# Altium schematic sheet LdcPower.SchDoc
size A4
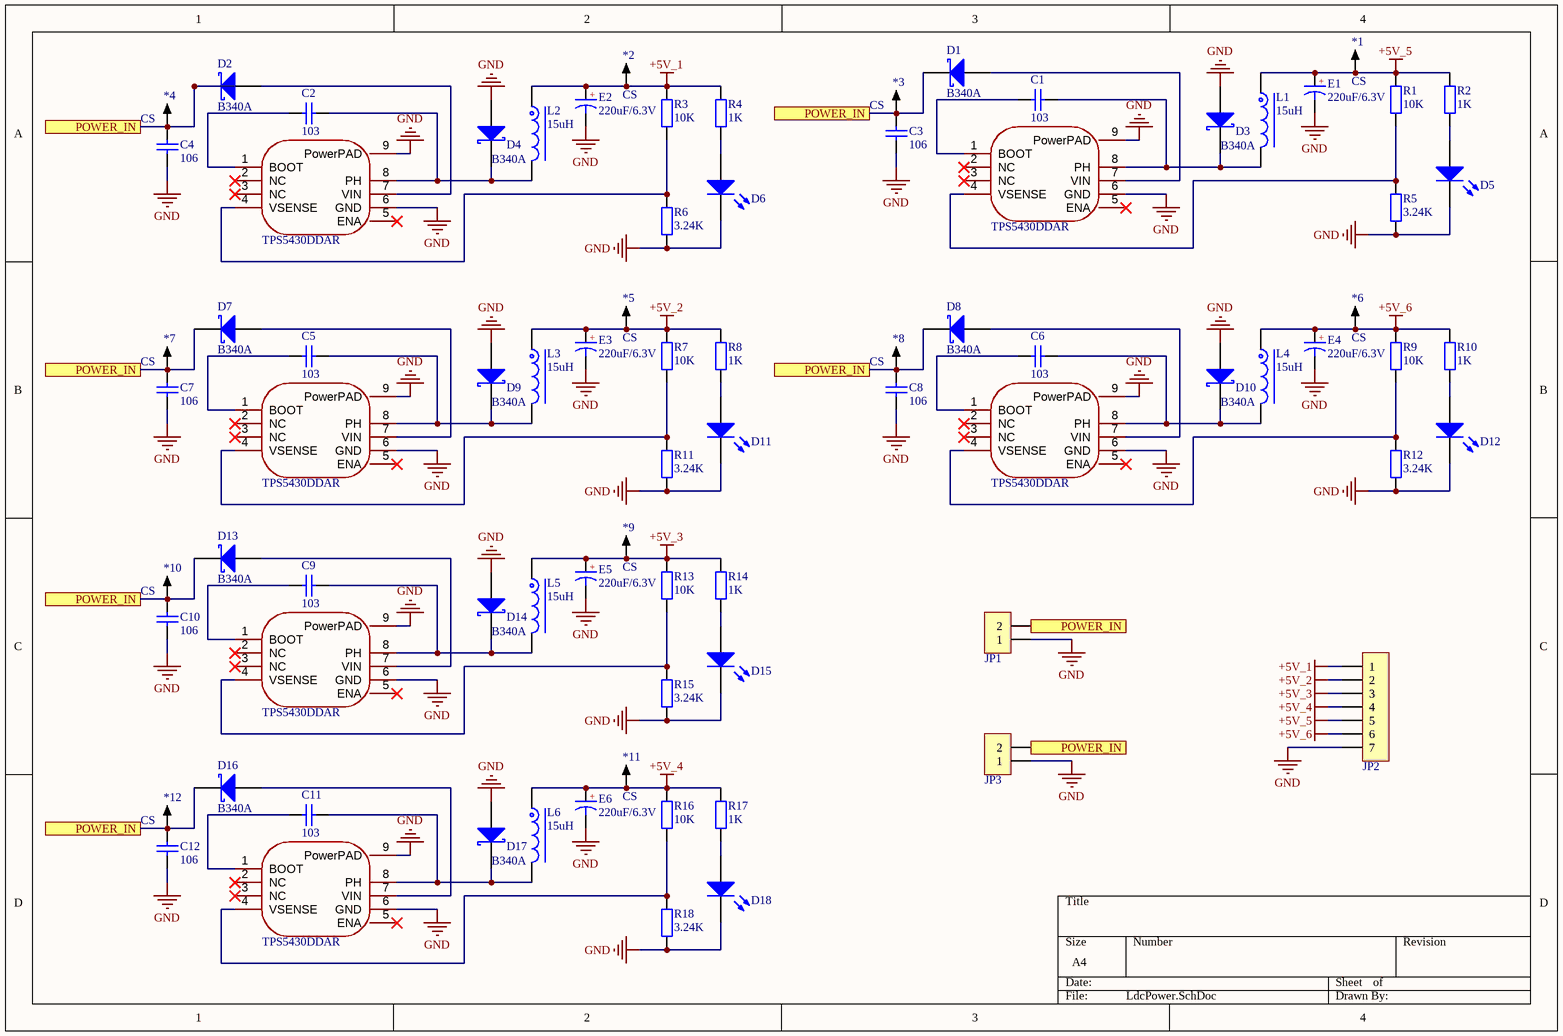
[diagram p0: LdcPower.SchDoc]

## Parts
*1  CS  [TEST 1.2]
*2  CS  [TEST 1.2]
*3  CS  [TEST 1.2]
*4  CS  [TEST 1.2]
*5  CS  [TEST 1.2]
*6  CS  [TEST 1.2]
*7  CS  [TEST 1.2]
*8  CS  [TEST 1.2]
*9  CS  [TEST 1.2]
*10  CS  [TEST 1.2]
*11  CS  [TEST 1.2]
*12  CS  [TEST 1.2]
C1  103  [C0603_L]
C2  103  [C0603_L]
C3  106  [C0603_L]
C4  106  [C0603_L]
C5  103  [C0603_L]
C6  103  [C0603_L]
C7  106  [C0603_L]
C8  106  [C0603_L]
C9  103  [C0603_L]
C10  106  [C0603_L]
C11  103  [C0603_L]
C12  106  [C0603_L]
D1  B340A  [SMA]
D2  B340A  [SMA]
D3  B340A  [SMA]
D4  B340A  [SMA]
D5  LED  [LED0603_R]  (value not drawn)
D6  LED  [LED0603_R]  (value not drawn)
D7  B340A  [SMA]
D8  B340A  [SMA]
D9  B340A  [SMA]
D10  B340A  [SMA]
D11  LED  [LED0603_R]  (value not drawn)
D12  LED  [LED0603_R]  (value not drawn)
D13  B340A  [SMA]
D14  B340A  [SMA]
D15  LED  [LED0603_R]  (value not drawn)
D16  B340A  [SMA]
D17  B340A  [SMA]
D18  LED  [LED0603_R]  (value not drawn)
E1  220uF/6.3V  [C_3528]
E2  220uF/6.3V  [C_3528]
E3  220uF/6.3V  [C_3528]
E4  220uF/6.3V  [C_3528]
E5  220uF/6.3V  [C_3528]
E6  220uF/6.3V  [C_3528]
JP1  HDR-1X2  [CONN-TH_XT60PW-M]  (value not drawn)
JP2  HDR-1X7  [CONN-SMD_7P-P2.54_MEGASTAR_ZX-XH2.54-7PWT]  (value not drawn)
JP3  HDR-1X2  [CONN-SMD_2P-P2.54_MEGASTAR_ZX-XH2.54-2PWT]  (value not drawn)
L1  15uH  [L-SMD-0630]
L2  15uH  [L-SMD-0630]
L3  15uH  [L-SMD-0630]
L4  15uH  [L-SMD-0630]
L5  15uH  [L-SMD-0630]
L6  15uH  [L-SMD-0630]
R1  10K  [R0603_L]
R2  1K  [R0603_L]
R3  10K  [R0603_L]
R4  1K  [R0603_L]
R5  3.24K  [R0603_L]
R6  3.24K  [R0603_L]
R7  10K  [R0603_L]
R8  1K  [R0603_L]
R9  10K  [R0603_L]
R10  1K  [R0603_L]
R11  3.24K  [R0603_L]
R12  3.24K  [R0603_L]
R13  10K  [R0603_L]
R14  1K  [R0603_L]
R15  3.24K  [R0603_L]
R16  10K  [R0603_L]
R17  1K  [R0603_L]
R18  3.24K  [R0603_L]
U1  TPS5430DDAR  [SOIC-8_EP]
U2  TPS5430DDAR  [SOIC-8_EP]
U3  TPS5430DDAR  [SOIC-8_EP]
U4  TPS5430DDAR  [SOIC-8_EP]
U5  TPS5430DDAR  [SOIC-8_EP]
U6  TPS5430DDAR  [SOIC-8_EP]

## Ports
POWER_IN

## Nets
+5V_1: *2.1 E2.1(A) JP2.1 L2.1 R3.2 R4.2
+5V_2: *5.1 E3.1(A) JP2.2 L3.1 R7.2 R8.2
+5V_3: *9.1 E5.1(A) JP2.3 L5.1 R13.2 R14.2
+5V_4: *11.1 E6.1(A) JP2.4 L6.1 R16.2 R17.2
+5V_5: *1.1 E1.1(A) JP2.5 L1.1 R1.2 R2.2
+5V_6: *6.1 E4.1(A) JP2.6 L4.1 R9.2 R10.2
GND: C3.1 C4.1 C7.1 C8.1 C10.1 C12.1 D3.1(A) D4.1(A) D5.2(K) D6.2(K) D9.1(A) D10.1(A) D11.2(K) D12.2(K) D14.1(A) D15.2(K) D17.1(A) D18.2(K) E1.2(K) E2.2(K) E3.2(K) E4.2(K) E5.2(K) E6.2(K) JP1.1 JP2.7 JP3.1 R5.1 R6.1 R11.1 R12.1 R15.1 R18.1 U1.6(GND) U1.9(PowerPAD) U2.6(GND) U2.9(PowerPAD) U3.6(GND) U3.9(PowerPAD) U4.6(GND) U4.9(PowerPAD) U5.6(GND) U5.9(PowerPAD) U6.6(GND) U6.9(PowerPAD)
POWER_IN: *3.1 *4.1 *7.1 *8.1 *10.1 *12.1 C3.2 C4.2 C7.2 C8.2 C10.2 C12.2 D1.2(K) D2.2(K) D7.2(K) D8.2(K) D13.2(K) D16.2(K) JP1.2 JP3.2 ; port POWER_IN
NetC1_1: C1.1 U1.1(BOOT)
NetC1_2: C1.2 D3.2(K) L1.2 U1.8(PH)
NetC2_1: C2.1 U2.1(BOOT)
NetC2_2: C2.2 D4.2(K) L2.2 U2.8(PH)
NetC5_1: C5.1 U3.1(BOOT)
NetC5_2: C5.2 D9.2(K) L3.2 U3.8(PH)
NetC6_1: C6.1 U4.1(BOOT)
NetC6_2: C6.2 D10.2(K) L4.2 U4.8(PH)
NetC9_1: C9.1 U5.1(BOOT)
NetC9_2: C9.2 D14.2(K) L5.2 U5.8(PH)
NetC11_1: C11.1 U6.1(BOOT)
NetC11_2: C11.2 D17.2(K) L6.2 U6.8(PH)
NetD1_1: D1.1(A) U1.7(VIN)
NetD2_1: D2.1(A) U2.7(VIN)
NetD5_1: D5.1(A) R2.1
NetD6_1: D6.1(A) R4.1
NetD7_1: D7.1(A) U3.7(VIN)
NetD8_1: D8.1(A) U4.7(VIN)
NetD11_1: D11.1(A) R8.1
NetD12_1: D12.1(A) R10.1
NetD13_1: D13.1(A) U5.7(VIN)
NetD15_1: D15.1(A) R14.1
NetD16_1: D16.1(A) U6.7(VIN)
NetD18_1: D18.1(A) R17.1
NetR1_1: R1.1 R5.2 U1.4(VSENSE)
NetR3_1: R3.1 R6.2 U2.4(VSENSE)
NetR7_1: R7.1 R11.2 U3.4(VSENSE)
NetR9_1: R9.1 R12.2 U4.4(VSENSE)
NetR13_1: R13.1 R15.2 U5.4(VSENSE)
NetR16_1: R16.1 R18.2 U6.4(VSENSE)

Not connected (* = marked no-connect by the designer): U1 2(NC)* 3(NC)* 5(ENA)*; U2 2(NC)* 3(NC)* 5(ENA)*; U3 2(NC)* 3(NC)* 5(ENA)*; U4 2(NC)* 3(NC)* 5(ENA)*; U5 2(NC)* 3(NC)* 5(ENA)*; U6 2(NC)* 3(NC)* 5(ENA)*

## Notes on the sheet
- (in symbol CT) +

## Library data of the parts
*1-*12 = CS: 探针焊盘; 联系下单店铺卖家 免费技术支持: 联系下单店铺卖家 免费帮你查找封装; BOM名称: 探针焊盘
C1-C12 = C: 贴片电容/MLCC电容; BOM名称: 无极性贴片电容; 联系下单店铺卖家 免费帮你查找封装: 联系下单店铺卖家 免费技术支持
D1-D4 D7-D10 D13 D14 D16 D17 = D-Schottky: 肖特基二极管; 当前库版本V2023.10.25 @淘宝卖家:黄晶宝石: 最新版本发布https://item.taobao.com/item.htm?id=566775463719
D5 D6 D11 D12 D15 D18 = LED0: 发光二极管; Published: 8-Jun-2000; LatestRevisionDate: 08-Jul-2005; LatestRevisionNote: Mech Layer 1 removed.; PackageReference: LED-0; Publisher: Altium Limited
E1-E6 = CT: 贴片钽电容; 联系下单店铺卖家 免费帮你查找封装: 联系下单店铺卖家 免费技术支持; 当前库版本V2023.10.25 @淘宝卖家:黄晶宝石: 最新版本发布https://item.taobao.com/item.htm?id=566775463719; BOM名称: 贴片钽电容
JP1 JP3 = Header 2: 2P接插件; 联系卖家，免费查找封装: 唯一出售店铺网址https://shop463601444.taobao.com; 封装库来自淘宝卖家ID：黄晶宝石: 其他店铺购入均为盗版封装库，请立即申请退款，本店现金奖励50~200元; BOM名称: 2P接插件
JP2 = Header 7: 7P接插件; 联系卖家，免费查找封装: 唯一出售店铺网址https://shop463601444.taobao.com; 封装库来自淘宝卖家ID：黄晶宝石: 其他店铺购入均为盗版封装库，请立即申请退款，本店现金奖励50~200元; BOM名称: 7P接插件
L1-L6 = L-Molding Choke: 一体成型电感; 联系下单店铺卖家 免费帮你查找封装: 联系下单店铺卖家 免费技术支持; 当前库版本V2023.10.25 @淘宝卖家:黄晶宝石: 最新版本发布https://item.taobao.com/item.htm?id=566775463719; BOM名称: 一体成型电感
R1-R18 = R: 贴片电阻; 联系下单店铺卖家 免费帮你查找封装: 联系下单店铺卖家 免费技术支持; BOM名称: 贴片电阻
U1-U6 = TPS5430DDAR: Symbol: TPS5430DDAR